# Altium schematic sheet Main Sheet.SchDoc
size A4; SheetNumber: 1; SheetTotal: 5
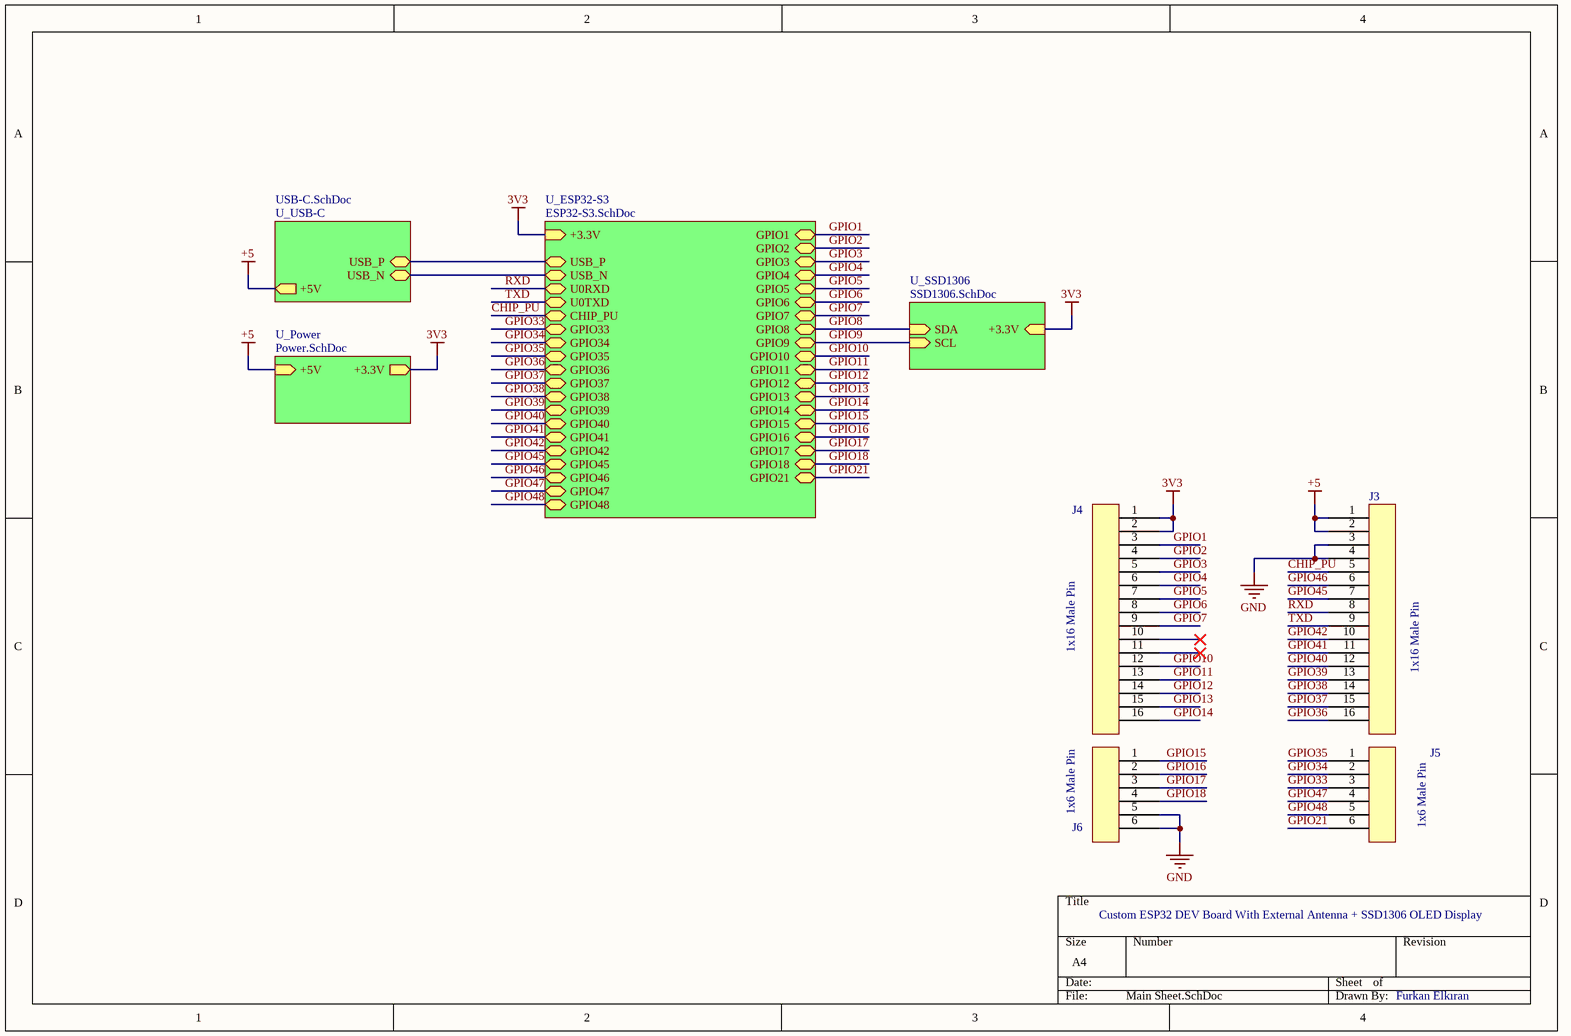
[diagram p0: Main Sheet.SchDoc]

## Parts
J3  1x16 Male Pin  [1x16 Male Pin]
J4  1x16 Male Pin  [1x16 Male Pin]
J5  1x6 Male Pin  [1x6 Male Pin]
J6  1x6 Male Pin  [1x6 Male Pin]

## Sub-sheets
U_ESP32-S3 = ESP32-S3.SchDoc: GPIO1 (bidir), GPIO2 (bidir), GPIO3 (bidir), GPIO4 (bidir), GPIO5 (bidir), GPIO6 (bidir), GPIO7 (bidir), GPIO8 (bidir), GPIO9 (bidir), GPIO10 (bidir), GPIO11 (bidir), GPIO12 (bidir), GPIO13 (bidir), GPIO14 (bidir), GPIO17 (bidir), GPIO18 (bidir), GPIO21 (bidir), GPIO35 (bidir), GPIO36 (bidir), GPIO37 (bidir), GPIO38 (bidir), GPIO45 (bidir), GPIO46 (bidir), USB_N (bidir), USB_P (bidir), GPIO41 (bidir), GPIO40 (bidir), GPIO39 (bidir), GPIO42 (bidir), U0TXD (bidir), U0RXD (bidir), +3.3V (in), GPIO15 (bidir), GPIO16 (bidir), GPIO47 (bidir), GPIO48 (bidir), CHIP_PU (bidir), GPIO33 (bidir), GPIO34 (bidir)
U_Power = Power.SchDoc: +5V (in), +3.3V (out)
U_SSD1306 = SSD1306.SchDoc: +3.3V (in), SCL (in), SDA (in)
U_USB-C = USB-C.SchDoc: USB_P (bidir), USB_N (bidir), +5V (out)

## Nets
3V3: J4.1 J4.2 ; sheet U_ESP32-S3/+3.3V, sheet U_Power/+3.3V, sheet U_SSD1306/+3.3V
+5: J3.1 J3.2 ; sheet U_Power/+5V, sheet U_USB-C/+5V
GND: J3.3 J3.4 J6.5 J6.6
CHIP_PU: J3.5 ; sheet U_ESP32-S3/CHIP_PU
GPIO1: J4.3 ; sheet U_ESP32-S3/GPIO1
GPIO2: J4.4 ; sheet U_ESP32-S3/GPIO2
GPIO3: J4.5 ; sheet U_ESP32-S3/GPIO3
GPIO4: J4.6 ; sheet U_ESP32-S3/GPIO4
GPIO5: J4.7 ; sheet U_ESP32-S3/GPIO5
GPIO6: J4.8 ; sheet U_ESP32-S3/GPIO6
GPIO7: J4.9 ; sheet U_ESP32-S3/GPIO7
GPIO8: sheet U_ESP32-S3/GPIO8, sheet U_SSD1306/SDA
GPIO9: sheet U_ESP32-S3/GPIO9, sheet U_SSD1306/SCL
GPIO10: J4.12 ; sheet U_ESP32-S3/GPIO10
GPIO11: J4.13 ; sheet U_ESP32-S3/GPIO11
GPIO12: J4.14 ; sheet U_ESP32-S3/GPIO12
GPIO13: J4.15 ; sheet U_ESP32-S3/GPIO13
GPIO14: J4.16 ; sheet U_ESP32-S3/GPIO14
GPIO15: J6.1 ; sheet U_ESP32-S3/GPIO15
GPIO16: J6.2 ; sheet U_ESP32-S3/GPIO16
GPIO17: J6.3 ; sheet U_ESP32-S3/GPIO17
GPIO18: J6.4 ; sheet U_ESP32-S3/GPIO18
GPIO21: J5.6 ; sheet U_ESP32-S3/GPIO21
GPIO33: J5.3 ; sheet U_ESP32-S3/GPIO33
GPIO34: J5.2 ; sheet U_ESP32-S3/GPIO34
GPIO35: J5.1 ; sheet U_ESP32-S3/GPIO35
GPIO36: J3.16 ; sheet U_ESP32-S3/GPIO36
GPIO37: J3.15 ; sheet U_ESP32-S3/GPIO37
GPIO38: J3.14 ; sheet U_ESP32-S3/GPIO38
GPIO39: J3.13 ; sheet U_ESP32-S3/GPIO39
GPIO40: J3.12 ; sheet U_ESP32-S3/GPIO40
GPIO41: J3.11 ; sheet U_ESP32-S3/GPIO41
GPIO42: J3.10 ; sheet U_ESP32-S3/GPIO42
GPIO45: J3.7 ; sheet U_ESP32-S3/GPIO45
GPIO46: J3.6 ; sheet U_ESP32-S3/GPIO46
GPIO47: J5.4 ; sheet U_ESP32-S3/GPIO47
GPIO48: J5.5 ; sheet U_ESP32-S3/GPIO48
RXD: J3.8 ; sheet U_ESP32-S3/U0RXD
TXD: J3.9 ; sheet U_ESP32-S3/U0TXD
(unnamed): sheet U_ESP32-S3/USB_N, sheet U_USB-C/USB_N
(unnamed): sheet U_ESP32-S3/USB_P, sheet U_USB-C/USB_P

Not connected (* = marked no-connect by the designer): J4 10* 11*

## Notes on the sheet
- Custom ESP32 DEV Board With External Antenna + SSD1306 OLED Display
- Furkan Elkıran